# EAGLE design linak_lin (EAGLE 6.5.0)
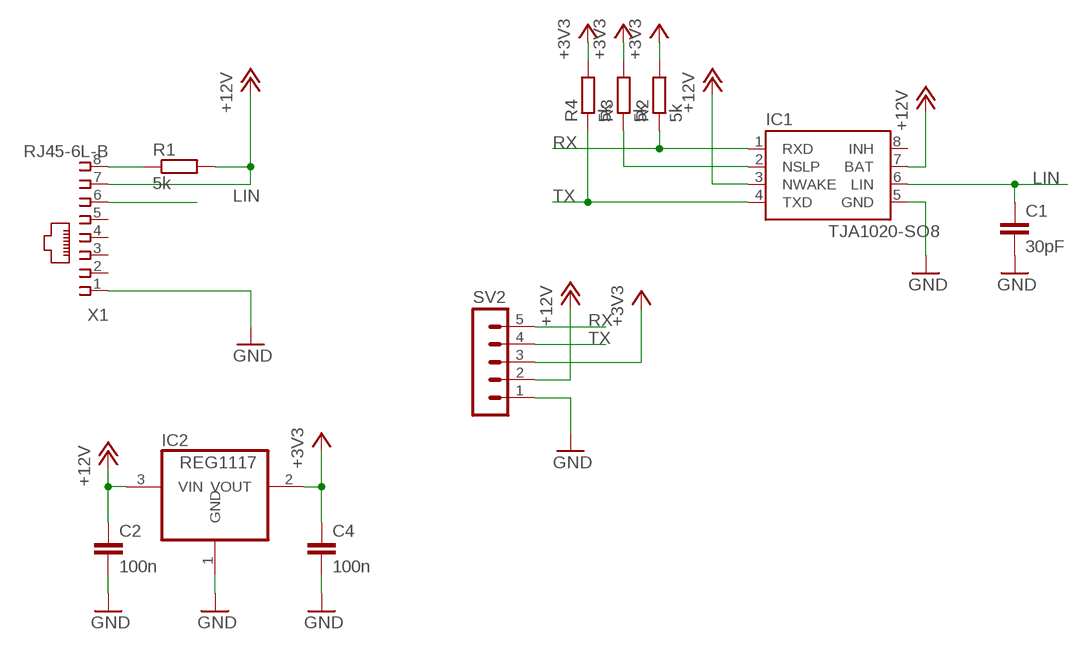
[diagram p0: schematic, sheet 1]

## Parts
C1  30pF  C-EUC1206  [C1206]
C2  100n  C-EUC1206  [C1206]
C4  100n  C-EUC1206  [C1206]
IC1  TJA1020-SO8  [SO08]
IC2  REG1117  [SOT223]
R1  5k  R-EU_R1206  [R1206]
R2  5k  R-EU_R1206  [R1206]
R3  5k  R-EU_R1206  [R1206]
R4  5k  R-EU_R1206  [R1206]
SV2  MA05-1  [MA05-1]
X1  RJ45-6L-B  [RJ45-NO-SHIELD]

## Nets
+3V3: C4.1 IC2.2(VOUT) R2.2 R3.2 R4.2 SV2.3
+12V: C2.1 IC1.3(NWAKE) IC1.7(BAT) IC2.3(VIN) R1.2 SV2.2 X1.7
GND: C1.2 C2.2 C4.2 IC1.5(GND) IC2.1(GND) SV2.1 X1.1
LIN: C1.1 IC1.6(LIN) X1.6
N$4: R1.1 X1.8
N$5: IC1.2(NSLP) R3.1
RX: IC1.1(RXD) R2.1 SV2.5
TX: IC1.4(TXD) R4.1 SV2.4
Unconnected: IC1.8(INH) X1.2 X1.3 X1.4 X1.5

## Library data of the parts
C1 C2 C4 = rcl:C-EU: CAPACITOR, European symbol
IC1 = tja1020:TJA1020-SO8: Adjustable Output Low Dropout Voltage Regulator 800 mA Source: http://www.onsemi.com/pub/Collateral/MC33269-D.PDF
IC2 = burr-brown:REG1117: 800mA and 1A Low Dropout (LDO) Positive Regulator 1.8V, 2.5V, 2.85V, 3.3V, 5V, and Adj; MPN: REG1117; OC_FARNELL: 1097566; OC_NEWARK: 14P6981
R1-R4 = resistor:R-EU_: RESISTOR, European symbol
SV2 = con-lstb:MA05-1: PIN HEADER; OC_FARNELL: unknown; OC_NEWARK: unknown
X1 = con-tycoelectronics:RJ45: CORCOM Modular RJ Jacks No Shield Source: www.tycoelectronics.com .. ENG_DS_1654001_1099_RJ_L_0507.pdf; MPN: RJ45-6L-B; OC_FARNELL: unknown; OC_NEWARK: 16R6090

## Board
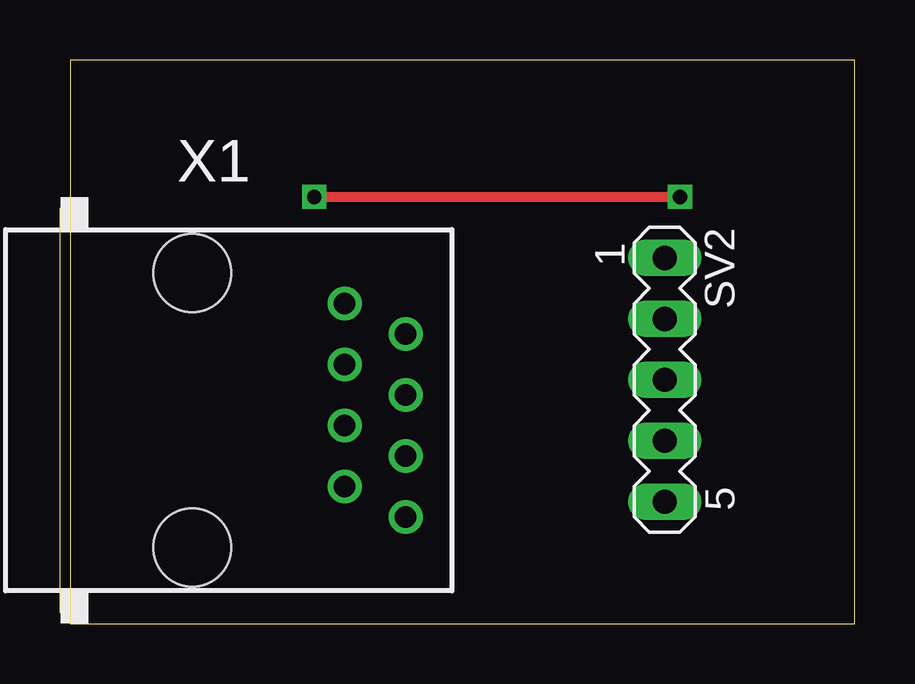
[diagram p1: board, top side]
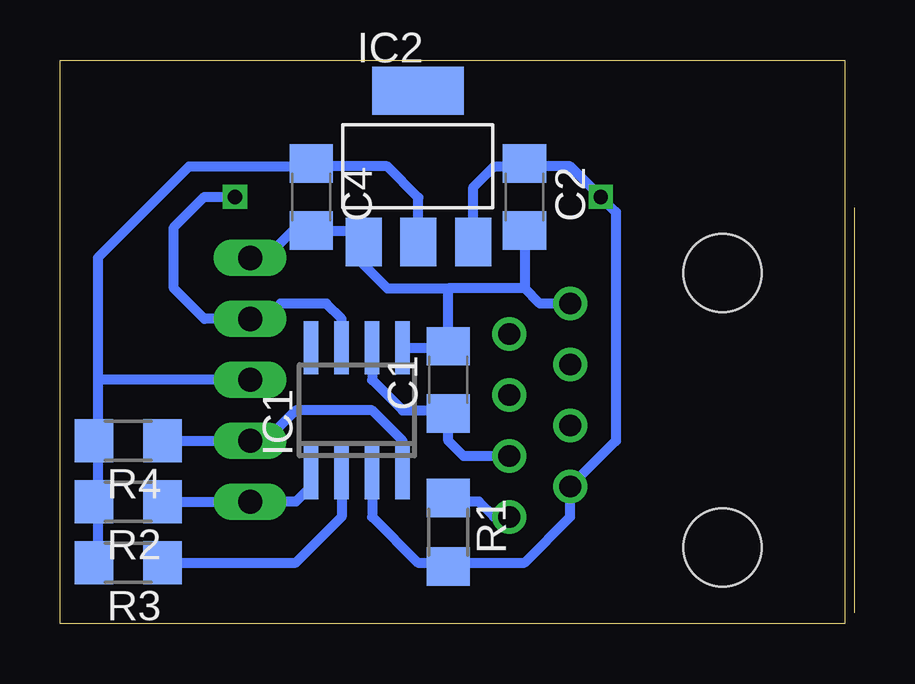
[diagram p2: board, bottom side, seen from below]

Size 32.69 x 23.48 mm. Coordinates in mm from the lower left corner, seen from the top.
Outline: 0,0 32.69,0 32.69,23.48 0,23.48 0,0
Copper layers (1*16): Top 0.035mm / dielectric 1.5mm / Bottom 0.035mm
Design rules "default": minimum track width 10mil, minimum drill 24mil, track to track 8mil, track to pad 8mil, pad to pad 8mil, via to via 8mil, smd to smd 8mil, copper to edge 40mil, drill to drill 8mil, minimum pad ring 10mil, minimum via ring 8mil, stop-mask expansion 4mil, vias tented up to drill 0mil, thermal gap 10mil

### Footprints (pad centres in the part's own frame; a part is rotated, then mirrored left to right if it is on the bottom)
C1206 = smd 1.6 x 1.8: 1 -1.4,0; 2 1.4,0
SO08 = smd 0.6 x 2.2: 1 -1.905,-2.6; 2 -0.635,-2.6; 3 0.635,-2.6; 4 1.905,-2.6; 5 1.905,2.6; 6 0.635,2.6; 7 -0.635,2.6; 8 -1.905,2.6
SOT223 = smd 1.499 x 2.007: 1 -2.261,-3.15; 2 0.025,-3.15; 3 2.311,-3.15 | smd 3.81 x 2.007: 4 0,3.15
R1206 = smd 1.6 x 1.803: 1 -1.422,0; 2 1.422,0
MA05-1 = drill 1.016 long: 1 -5.08,0; 2 -2.54,0; 3 0,0; 4 2.54,0; 5 5.08,0
RJ45-NO-SHIELD = drill 0.9 pad 1.4: 1 -4.445,6.35; 2 -3.175,8.89; 3 -1.905,6.35; 4 -0.635,8.89; 5 0.635,6.35; 6 1.905,8.89; 7 3.175,6.35; 8 4.445,8.89 | hole 3.251: -5.715,0; 5.715,0

### Placement (x,y rotation side)
C1  16.51,10.16 90 bottom
C2  13.34,17.78 270 bottom
C4  22.23,17.78 270 bottom
IC1  20.32,8.89 0 bottom
IC2  17.78,19.05 0 bottom
R1  16.51,3.81 270 bottom
R2  29.84,5.08 180 bottom
R3  29.84,2.54 180 bottom
R4  29.84,7.62 180 bottom
SV2  24.77,10.16 270 top
X1  5.08,8.89 270 top

### Tracks (layer width: path | path; a pad name or v marks a point on that pad's centre or on a via)
+3V3
  Bottom 0.406: 22.73,19.18 C4.1 22.86,19.07 | 22.86,19.07 22.99,19.05 27.3,19.05 31.11,15.24 31.11,10.16 | R4.2 31.11,7.62 | 31.11,5.23 R2.2 | SV2.3 31.11,10.16 | IC2.2 17.75,17.75 19.05,19.05 22.84,19.05 22.86,19.07 | 31.11,10.16 31.11,7.62 | 31.11,7.62 31.11,5.23 | 31.11,5.23 31.11,2.69 R3.2
+12V  (via drill 0.6)
  Top 0.406: v10.16,17.78 v25.4,17.78
  Bottom 0.406: R1.2 16.36,2.54 13.34,2.54 11.43,4.45 X1.7 9.53,7.62 9.53,17.14 v10.16,17.78 11.43,19.05 12.57,19.05 C2.1 | 16.99,1.91 R1.2 | IC1.3 19.68,4.45 17.78,2.54 16.66,2.54 R1.2 | v25.4,17.78 26.67,17.78 27.94,16.51 27.94,13.97 26.67,12.7 SV2.2 24.13,12.7 23.5,13.34 21.59,13.34 20.95,12.7 IC1.7 | 12.83,19.05 C2.1 | IC2.3 15.47,18.19 14.61,19.05 13.46,19.05 C2.1
GND
  Bottom 0.406: X1.1 12.7,13.34 13.34,13.97 | 13.34,13.97 16.51,13.97 | 20.32,16.51 20.45,16.38 C4.2 22.99,16.38 24.13,15.24 SV2.1 | 16.51,13.97 C1.2 16.58,11.49 IC1.5 | C2.2 13.34,13.97 | 20.32,16.51 20.32,15.24 19.05,13.97 16.51,13.97 | IC2.1 20.04,16.23 20.32,16.51
LIN
  Bottom 0.406: X1.6 15.88,6.99 16.51,7.62 C1.1 16.64,8.89 18.41,8.89 19.68,10.16 IC1.6
N$1  (via drill 0.6)
  other vias: 5.08,14.61
N$2  (via drill 0.6)
  other vias: 5.08,3.17
N$4
  Bottom 0.406: X1.8 14.61,4.45 15.24,5.08 16.36,5.08 R1.1
N$5
  Bottom 0.406: IC1.2 20.95,4.45 22.86,2.54 R3.1
RX
  Bottom 0.406: R2.1 SV2.5 22.86,5.08 22.23,5.71 IC1.1
TX
  Bottom 0.406: IC1.4 18.41,7.62 19.68,8.89 22.86,8.89 24.13,7.62 SV2.4 R4.1
(copper drawn outside any net)
  shapes: Bottom circle x2